# Altium schematic sheet POWER.SchDoc: Power
size A4; Date: 2016-06-28; Author: Vitali Tsiukala; DrawnBy: Vitali Tsiukala; Engineer: Vitali Tsiukala; Organization: Trenz Electronic GmbH; DocumentNumber: TE0706; Revision: 02; SheetNumber: 9; SheetTotal: 10
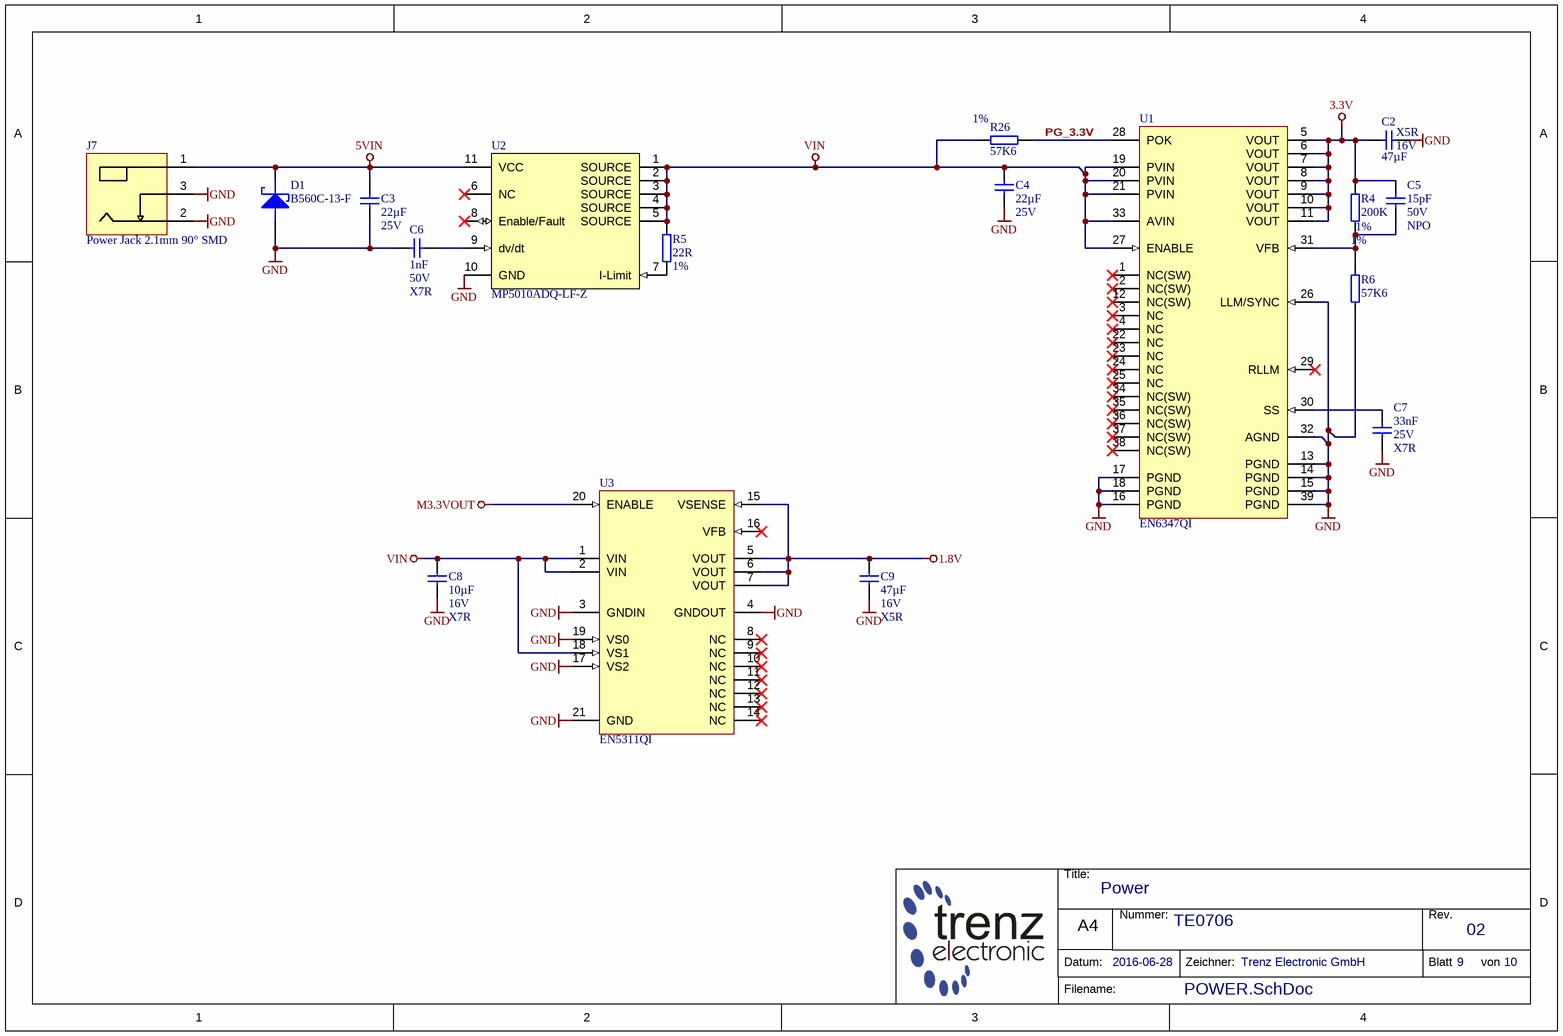
[diagram p0: POWER.SchDoc]

## Parts
C2  47µF  Voltage: 16V  Technology: X5R  [CAPC3216X180N]
C3  22µF  Voltage: 25V  [CAPC3216X180N]
C4  22µF  Voltage: 25V  [CAPC3216X180N]
C5  15pF  Voltage: 50V  Technology: NPO  [CAPC1005X55N]
C6  1nF  Voltage: 50V  Technology: X7R  [CAPC1005X55N]
C7  33nF  Voltage: 25V  Technology: X7R  [CAPC1005X55N]
C8  10µF  Voltage: 16V  Technology: X7R  [CAPC2012X135N]
C9  47µF  Voltage: 16V  Technology: X5R  [CAPC3216X180N]
D1  B560C-13-F  [DIOM7959X250N]
J7  Power Jack 2.1mm 90° SMD  [694106106102]
R4  200K  Tolerance: 1%  [RESC1005X40N]
R5  22R  Tolerance: 1%  [RESC1005X40N]
R6  57K6  Tolerance: 1%  [RESC1005X40N]
R26  57K6  Tolerance: 1%  [RESC1005X40N]
U1  EN6347QI  [EN63xx]
U2  MP5010ADQ-LF-Z  [SON50P300X300X100-11N]
U3  EN5311QI  [EN5311QI]

## Nets
1.8V: C9.1 U3.5(VOUT) U3.6(VOUT) U3.7(VOUT) U3.15(VSENSE)
3.3V: C2.1 C5.1 R4.1 U1.5(VOUT) U1.6(VOUT) U1.7(VOUT) U1.8(VOUT) U1.9(VOUT) U1.10(VOUT) U1.11(VOUT)
5VIN: C3.1 D1.1(KATHODE) J7.1 U2.11(VCC)
GND: C2.2 C3.2 C4.1 C6.1 C7.2 C8.2 C9.2 D1.2(ANODE) J7.2 J7.3 R6.2 U1.13(PGND) U1.14(PGND) U1.15(PGND) U1.16(PGND) U1.17(PGND) U1.18(PGND) U1.26(LLM/SYNC) U1.32(AGND) U1.39(PGND) U2.10(GND) U3.3(GNDIN) U3.4(GNDOUT) U3.17(VS2) U3.19(VS0) U3.21(GND)
M3.3VOUT: U3.20(ENABLE)
VIN: C4.2 C8.1 R5.1 R26.1 U1.19(PVIN) U1.20(PVIN) U1.21(PVIN) U1.27(ENABLE) U1.33(AVIN) U2.1(SOURCE) U2.2(SOURCE) U2.3(SOURCE) U2.4(SOURCE) U2.5(SOURCE) U3.1(VIN) U3.2(VIN) U3.18(VS1)
PG_3.3V: R26.2 U1.28(POK)
NetC5_2: C5.2 R4.2 R6.1 U1.31(VFB)
NetC6_2: C6.2 U2.9(dv/dt)
NetC7_1: C7.1 U1.30(SS)
NetR5_2: R5.2 U2.7(I-Limit)

Not connected (* = marked no-connect by the designer): U1 1(NC(SW))* 2(NC(SW))* 3(NC)* 4(NC)* 12(NC(SW))* 22(NC)* 23(NC)* 24(NC)* 25(NC)* 29(RLLM)* 34(NC(SW))* 35(NC(SW))* 36(NC(SW))* 37(NC(SW))* 38(NC(SW))*; U2 6(NC)* 8(Enable/Fault)*; U3 8(NC)* 9(NC)* 10(NC)* 11(NC)* 12(NC)* 13(NC)* 14(NC)* 16(VFB)*

## Notes on the sheet
- Title:
- Nummer:
- Rev.
- Datum:
- A4
- Zeichner:
- Blatt
- von
- Filename:

## Library data of the parts
C2 = 24955: KON 47µF 16V  X5R SMD 20%; AN: 24955; Value: 47u; Mixed: SMT; Preferred: Yes; Case: 3216 (1206); Tolerance: 20%
C3 = 24886: KON 22µF X5R 25V SMD 10%; AN: 24886; Mixed: SMT; Value: 22u; Preferred: Yes; Case: 3216 (1206); Tolerance: 10%
C4 = 24886: KON 22µF X5R 25V SMD 10%; AN: 24886; Value: 22u; Mixed: SMT; Preferred: Yes; Case: 3216 (1206); Tolerance: 10%
C5 = 23951: KON 15pF NPO 50V SMD; AN: 23951; Value: 15p; Mixed: SMT; Preferred: Yes; Case: 1005 (0402)
C6 = 22471: KON 1nF 50V X7R SMD; AN: 22471; Mixed: SMT; Value: 1n; Tolerance: 10%; Preferred: Yes; Case: 1005 (0402)
C7 = 23916: KON 33nF 25V X7R SMD; AN: 23916; Value: 33n; Mixed: SMT; Preferred: Yes; Case: 1005 (0402)
C8 = 24380: KON 10µF 16V X7R SMD 10%; AN: 24380; Mixed: SMT; Value: 10u; Preferred: Yes; Case: 2012 (0805); Tolerance: 10%
C9 = 24955: KON 47µF 16V  X5R SMD 20%; AN: 24955; Mixed: SMT; Value: 47u; Preferred: Yes; Case: 3216 (1206); Tolerance: 20%
D1 = 25311: B560C-13-F SMD; AN: 25311; Mixed: SMT; Trenz-Stock: Yes; Case: SMC; HelpURL: B:\AD\adlib\datasheet\B520C-B560C; H-ART: B560C-13-F
J7 = 26873: AN: 26873; Mixed: SMT; Trenz-Stock: Yes; HelpURL: B:\ad\adlib\datasheet\694106106102; H-ART: 694106106102
R4 = 23846: WID SMD 200K 1% 0,063W; AN: 23846; Mixed: SMT; Preferred: Yes; Case: 1005 (0402); Value: 200K; Technology: TK100
R5 = 25892: WID SMD 22R 1% 0,063W; AN: 25892; Mixed: SMT; Value: 22; Preferred: Yes; Case: 1005 (0402); Technology: TK100
R6 R26 = 24958: WID SMD 57K6 1% 0,063W; AN: 24958; Value: 57.6K; Mixed: SMT; Preferred: Yes; Case: 1005 (0402); Technology: TK100
U1 = 24486: AN: 24486; Trenz-Stock: Yes; Mixed: SMT; HelpURL: B:\AD\adlib\datasheet\EN6347QI; Preferred: Yes; H-ART: EN6347QI
U2 = 25620: AN: 25620; Mixed: SMT; Voltage: 5V; Case: DFN10; HelpURL: B:\AD\adlib\datasheet\MP5010; H-ART: MP5010ADQ-LF-Z
U3 = 25492: AN: 25492; Mixed: SMT; Trenz-Stock: Yes; Case: QFN20; HelpURL: B:\AD\adlib\datasheet\EN5311QI; Preferred: Yes; H-ART: EN5311QI